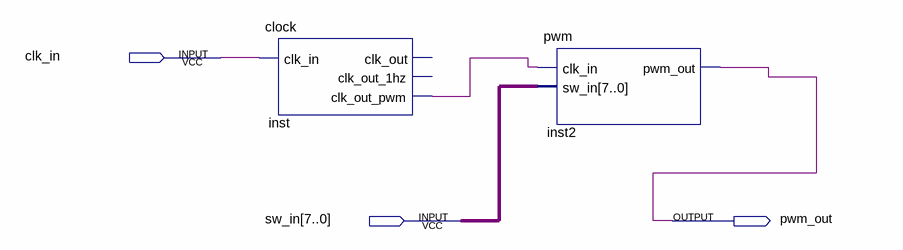
[diagram p0: schematic sheet]
// Quartus schematic pwm_bdf.bdf as structural Verilog: 2 symbols, 3 pins
module pwm_bdf (
  input  clk_in,
  input  [7:0] sw_in,
  output pwm_out
);

  wire inst_clk_out_pwm;

  clock inst (.clk_in(clk_in), .clk_out_pwm(inst_clk_out_pwm));  // open: clk_out, clk_out_1hz
  pwm inst2 (.clk_in(inst_clk_out_pwm), .sw_in(sw_in), .pwm_out(pwm_out));
endmodule
